# EAGLE design IO_master_nano (EAGLE 7.2.0)
AUTHOR: M. Petrilak; VERSION: 01
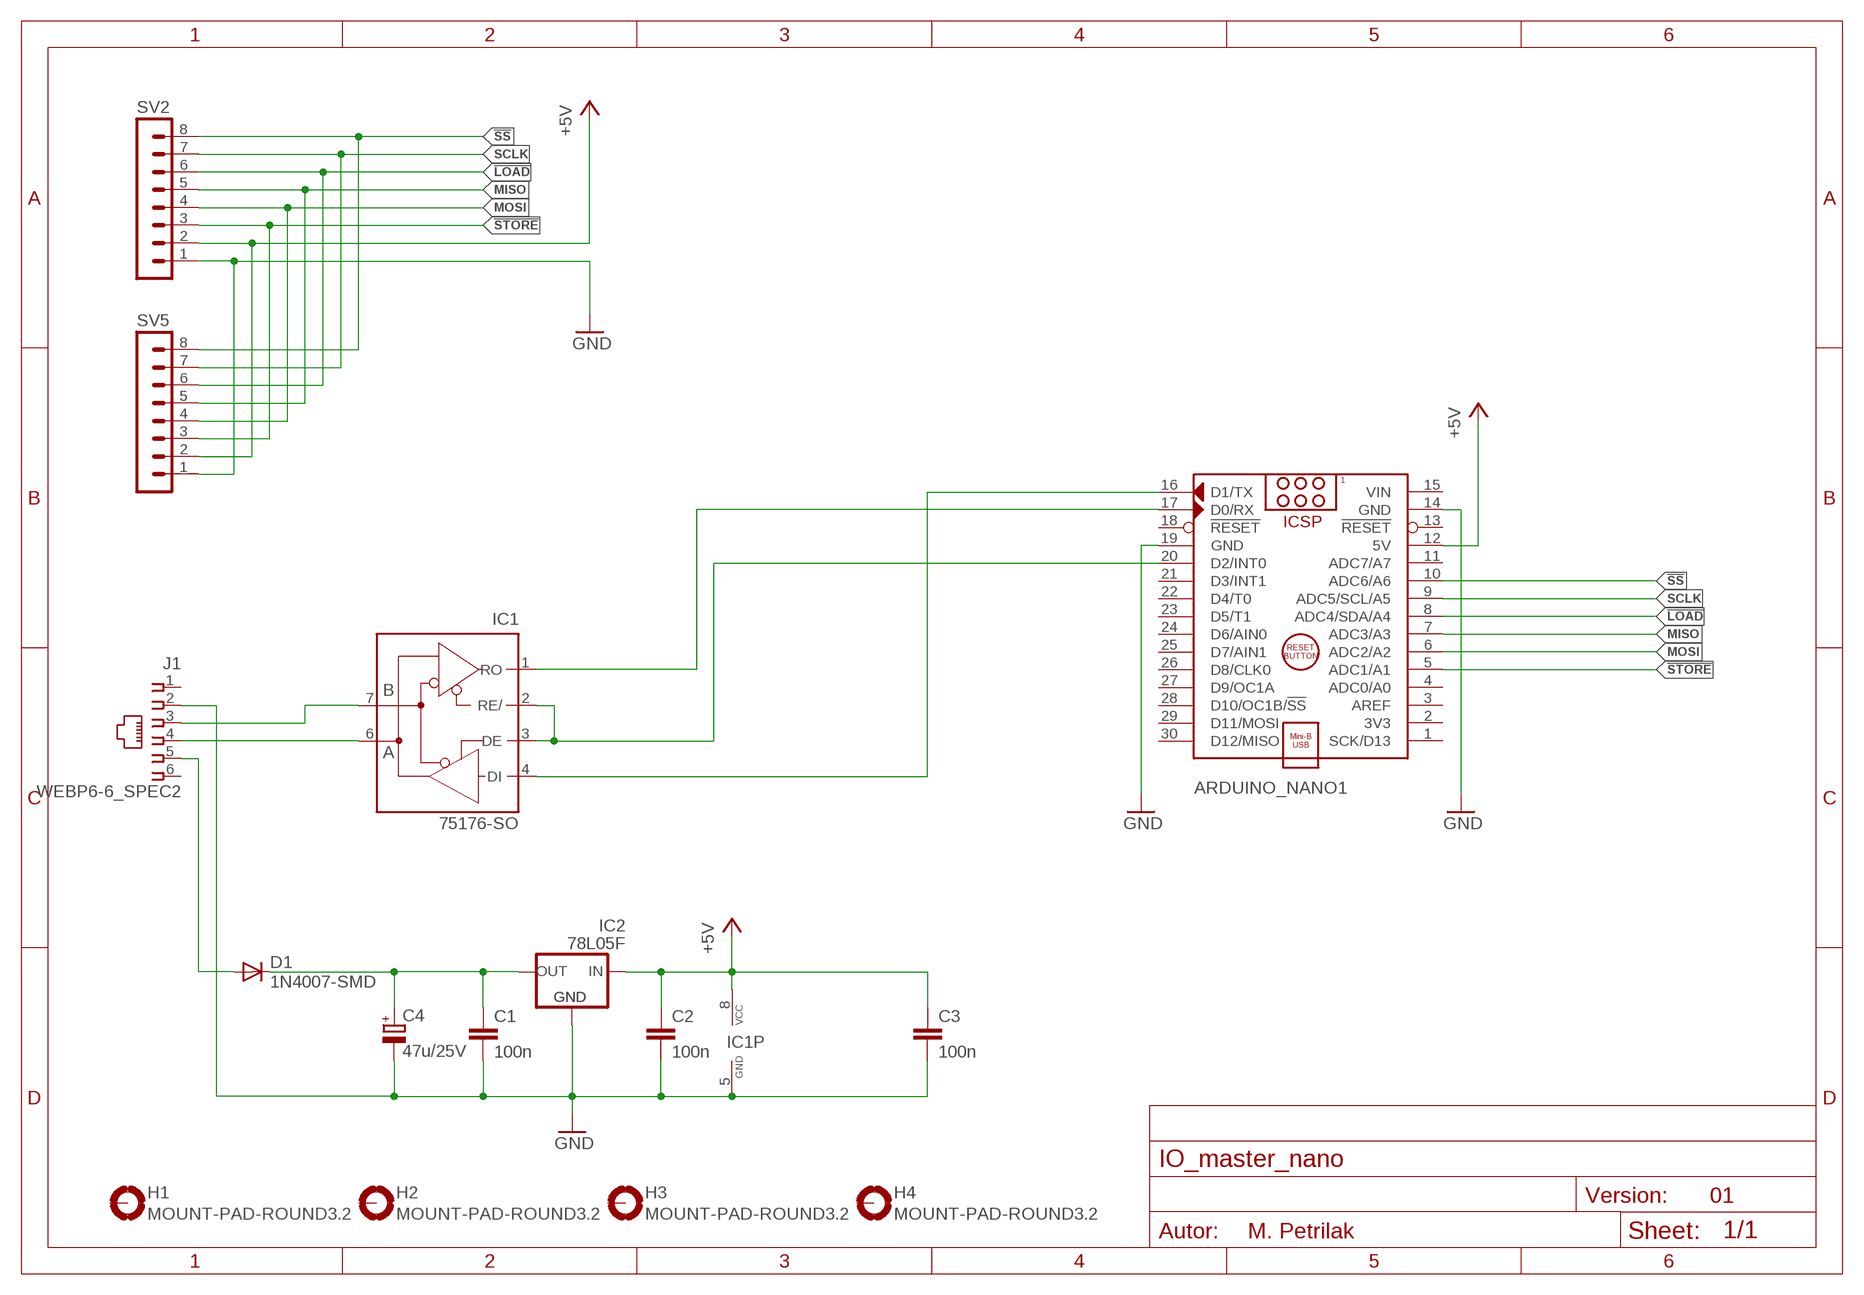
[diagram p0: schematic, sheet 1]

## Parts
ARDUINO_NANO1  ARDUINO_NANO_2  [ARDUINO_NANO2]
C1  100n  C-EUC1206  [C1206]
C2  100n  C-EUC1206  [C1206]
C3  100n  C-EUC1206  [C1206]
C4  47u/25V  CPOL-EUE2.5-6L  [E2,5-6L]
D1  1N4007-SMD  [SMA-DO214AC]
H1  MOUNT-PAD-ROUND3.2  [3,2-PAD]
H2  MOUNT-PAD-ROUND3.2  [3,2-PAD]
H3  MOUNT-PAD-ROUND3.2  [3,2-PAD]
H4  MOUNT-PAD-ROUND3.2  [3,2-PAD]
IC1  75176-SO  [SO08]
IC2  78L05F  [SOT89]
J1  WEBP6-6_SPEC2  [WEBP6-6_SPEC2]
SV2  MA08-1  [MA08-1]
SV5  MA08-1  [MA08-1]

## Nets
!LOAD: ARDUINO_NANO1.8(ADC4/SDA/A4) SV2.6 SV5.6
!SS: ARDUINO_NANO1.10(ADC6/A6) SV2.8 SV5.8
!STORE: ARDUINO_NANO1.5(ADC1/A1) SV2.3 SV5.3
+5V: ARDUINO_NANO1.12(5V) C2.1 C3.1 IC1.8(VCC) IC2.3(VI) SV2.2 SV5.2
GND: ARDUINO_NANO1.14(GND) ARDUINO_NANO1.19(GND) C1.2 C2.2 C3.2 C4.- IC1.5(GND) IC2.2(GND) IC2.2@1(GND) J1.2 SV2.1 SV5.1
MISO: ARDUINO_NANO1.7(ADC3/A3) SV2.5 SV5.5
MOSI: ARDUINO_NANO1.6(ADC2/A2) SV2.4 SV5.4
N$1: D1.A J1.5
N$2: C1.1 C4.+ D1.K(C) IC2.1(VO)
N$4: IC1.6(A) J1.4
N$5: IC1.7(B) J1.3
N$6: ARDUINO_NANO1.20(D2/INT0) IC1.2(RE/) IC1.3(DE)
N$7: ARDUINO_NANO1.16(D1/TX) IC1.4(DI)
N$8: ARDUINO_NANO1.17(D0/RX) IC1.1(RO)
SCLK: ARDUINO_NANO1.9(ADC5/SCL/A5) SV2.7 SV5.7
Unconnected: ARDUINO_NANO1.1(SCK/D13) ARDUINO_NANO1.2(3V3) ARDUINO_NANO1.3(AREF) ARDUINO_NANO1.4(ADC0/A0) ARDUINO_NANO1.11(ADC7/A7) ARDUINO_NANO1.13(!RESET) ARDUINO_NANO1.18(!RESET) ARDUINO_NANO1.21(D3/INT1) ARDUINO_NANO1.22(D4/T0) ARDUINO_NANO1.23(D5/T1) ARDUINO_NANO1.24(D6/AIN0) ARDUINO_NANO1.25(D7/AIN1) ARDUINO_NANO1.26(D8/CLK0) ARDUINO_NANO1.27(D9/OC1A) ARDUINO_NANO1.28(D10/OC1B/!SS) ARDUINO_NANO1.29(D11/MOSI) ARDUINO_NANO1.30(D12/MISO) H1.B3,2(MOUNT) H2.B3,2(MOUNT) H3.B3,2(MOUNT) H4.B3,2(MOUNT) J1.1 J1.6

## Power pins joined to a net without a drawn wire
VIN: ARDUINO_NANO1.15(VIN)

## Library data of the parts
ARDUINO_NANO1 = arduino:ARDUINO_NANO: Arduino Nano V3.0 Module Overview: The Arduino Nano is a small, complete, and breadboard-friendly board based on the ATmega328 (Arduino Nano 3.x) or ATmega168 (Arduino Nano 2.x). It has more or less the same functionality of the Arduino Duemilanove, but in a different package. It lacks only a DC power jack, and works with a Mini-B USB cable instead of a standard one. The Nano was designed and is being produced by Gravitech <http://www.gravitech.us/arna30wiatp.html>. General specifications: Item Value Microcontroller Atmel ATmega168 or ATmega328 Operating Voltage (logic level) 5 V Input Voltage (recommended) 7-12 V Input Voltage (limits) 6-20 V Digital I/O Pins 14 (of which 6 provide PWM output) Analog Input Pins 8 DC Current per I/O Pin 40 mA Flash Memory 16 KB (ATmega168) or 32 KB (ATmega328) of which 2 KB used by bootloader SRAM 1 KB (ATmega168) or 2 KB (ATmega328) EEPROM 512 bytes (ATmega168) or 1 KB (ATmega328) Clock Speed 16 MHz Dimensions (Inches) 0.73" x 1.70" Dimensions (mm) 18mm x 45mm Overall height About 9 mm (not including pins) Weigth 5 g Power: The Arduino Nano can be powered via the Mini-B USB connection, 6-20V unregulated external power supply (pin 30), or 5V regulated external power supply (pin 27). The power source is automatically selected to the highest voltage source. Memory: The ATmega168 has 16 KB of flash memory for storing code (of which 2 KB is used for the bootloader); the ATmega328 has 32 KB, (also with 2 KB used for the bootloader). The ATmega168 has 1 KB of SRAM and 512 bytes of EEPROM (which can be read and written with the EEPROM library); the ATmega328 has 2 KB of SRAM and 1 KB of EEPROM. Input and Output: Each of the 14 digital pins on the Nano can be used as an input or output, using pinMode(), digitalWrite(), and digitalRead() functions. They operate at 5 volts. Each pin can provide or receive a maximum of 40 mA and has an internal pull-up resistor (disconnected by default) of 20-50 kOhms. In addition, some pins have specialized functions. Visit Arduino - ArduinoBoardNano <https://www.arduino.cc/en/Main/ArduinoBoardNano>
C1-C3 = rcl:C-EU: CAPACITOR, European symbol
C4 = rcl:CPOL-EU: POLARIZED CAPACITOR, European symbol
D1 = diode:1N400: DIODE general purpose rectifier, 1 A
H1-H4 = holes:MOUNT-PAD-ROUND: MOUNTING PAD, round
IC1 = maxim:75176
IC2 = linear:78L*: POSITOIV-VOLTAGE REGULATORS Output up to 100 mA Source: http://focus.ti.com/lit/ds/symlink/ua78l05.pdf
J1 = con-malina:WEBP6-6
SV2 SV5 = con-lstb:MA08-1: PIN HEADER

## Board
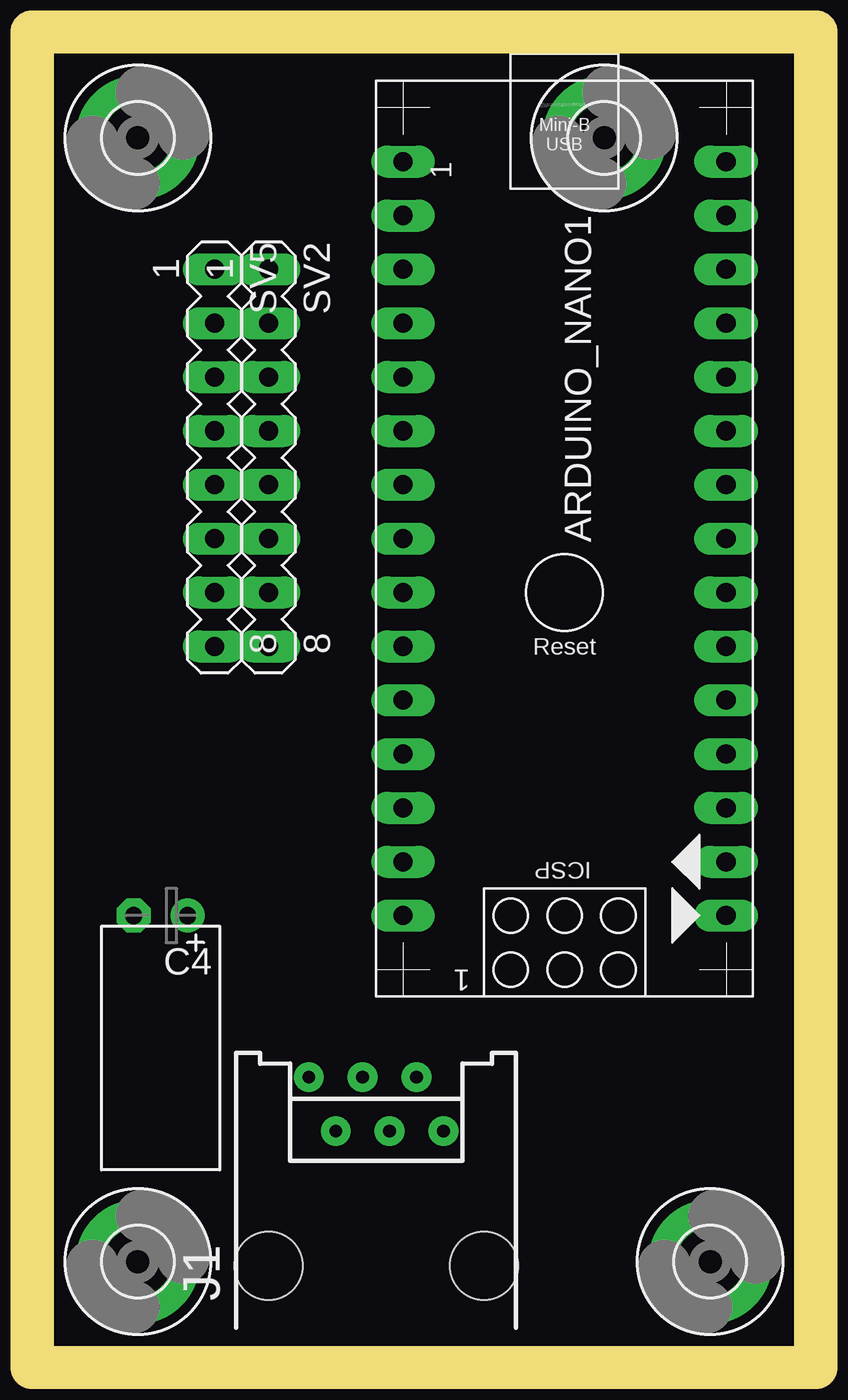
[diagram p1: board, top side]
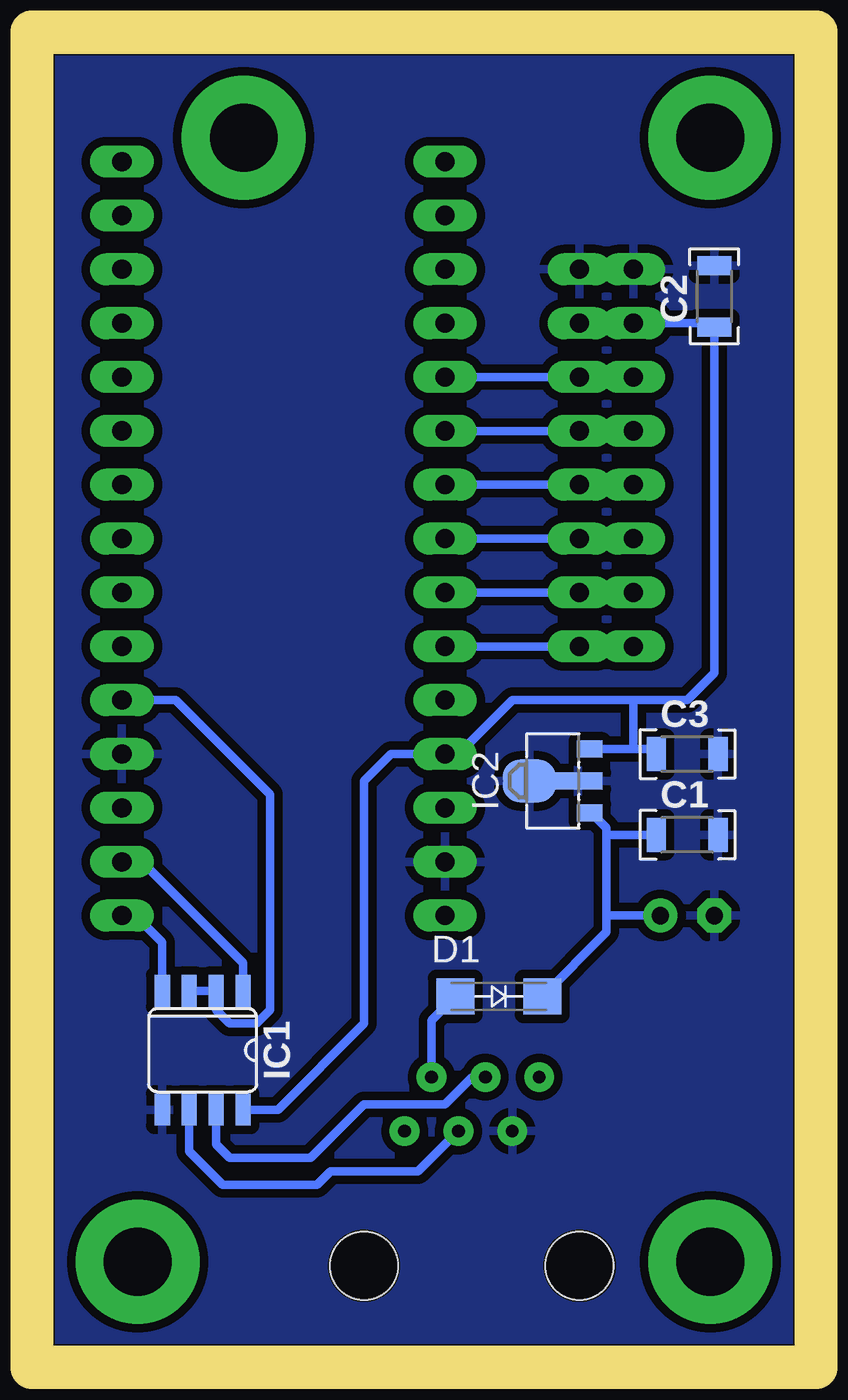
[diagram p2: board, bottom side, seen from below]

Size 35 x 61 mm. Coordinates in mm from the lower left corner, seen from the top.
Outline: 0,0 35,0 35,61 0,61 0,0
Copper layers (1*16): Top 0.035mm / dielectric 1.5mm / Bottom 0.035mm
Design rules "Michal_CNC_doma": minimum track width 0.3mm, minimum drill 0.6mm, track to track 0.4mm, track to pad 0.4mm, pad to pad 0.5mm, via to via 0.5mm, smd to smd 8mil, copper to edge 0.1mm, drill to drill 0.3mm, minimum pad ring 0.2mm, minimum via ring 0.2mm, stop-mask expansion 4mil, vias tented up to drill 0mil, thermal gap 0.4mm
Milling: 4 lines

### Footprints (pad centres in the part's own frame; a part is rotated, then mirrored left to right if it is on the bottom)
ARDUINO_NANO2 = drill 0.9 pad 1.5 long: 1 -20.32,-7.62; 2 -17.78,-7.62; 3 -15.24,-7.62; 4 -12.7,-7.62; 5 -10.16,-7.62; 6 -7.62,-7.62; 7 -5.08,-7.62; 8 -2.54,-7.62; 9 0,-7.62; 10 2.54,-7.62; 11 5.08,-7.62; 12 7.62,-7.62; 13 10.16,-7.62; 14 12.7,-7.62; 15 15.24,-7.62; 16 15.24,7.62; 17 12.7,7.62; 18 10.16,7.62; 19 7.62,7.62; 20 5.08,7.62; 21 2.54,7.62; 22 0,7.62; 23 -2.54,7.62; 24 -5.08,7.62; 25 -7.62,7.62; 26 -10.16,7.62; 27 -12.7,7.62; 28 -15.24,7.62; 29 -17.78,7.62; 30 -20.32,7.62
C1206 = smd 0.9 x 1.6: 1 -1.45,0; 2 1.45,0
E2,5-6L = drill 0.813 pad 1.6: + -1.27,0 | drill 0.813 pad 1.6 octagon: - 1.27,0
SMA-DO214AC = smd 1.8 x 1.7: A -2.05,0; K 2.05,0
3,2-PAD = drill 3.2 pad 5.842: B3,2 0,0
SO08 = smd 0.72 x 1.5: 1 -1.905,-2.8; 2 -0.635,-2.8; 3 0.635,-2.8; 4 1.905,-2.8; 5 1.905,2.8; 6 0.635,2.8; 7 -0.635,2.8; 8 -1.905,2.8
SOT89 = smd 0.8 x 1.2: 1 -1.5,-1.75; 3 1.499,-1.75 | smd 0.8 x 2.3: 2 0,-1.2 | smd 2 x 2.5: 2@1 0,1.1
WEBP6-6_SPEC2 = drill 0.6 pad 1.4: 1 -3.175,8.89; 2 -1.905,6.35; 3 -0.635,8.89; 4 0.635,6.35; 5 1.905,8.89; 6 3.175,6.35 | hole 3.2: -5.08,0; 5.08,0
MA08-1 = drill 0.9 pad 1.5 long: 1 -8.89,0; 2 -6.35,0; 3 -3.81,0; 4 -1.27,0; 5 1.27,0; 6 3.81,0; 7 6.35,0; 8 8.89,0

### Placement (x,y rotation side)
ARDUINO_NANO1  24.13,35.56 270 top
C1  5.08,24.13 0 bottom
C2  3.81,49.53 90 bottom
C3  5.08,27.94 0 bottom
C4  5.08,20.32 180 top
D1  13.97,16.51 0 bottom
H1  4,4 0 top
H2  31,4 0 top
H3  26,57 0 top
H4  4,57 0 top
IC1  27.94,13.97 180 bottom
IC2  11.43,26.67 90 bottom
J1  15.24,3.81 0 top
SV2  10.16,41.91 270 top
SV5  7.62,41.91 270 top

### Tracks (layer width: path | path; a pad name or v marks a point on that pad's centre or on a via)
!LOAD
  Bottom 0.406: SV5.6 SV2.6 ARDUINO_NANO1.8
!SS
  Bottom 0.406: SV5.8 SV2.8 ARDUINO_NANO1.10
!STORE
  Bottom 0.406: ARDUINO_NANO1.5 SV2.3 SV5.3
+5V
  Bottom 0.406: SV2.2 SV5.2 3.99,48.26 C2.1 3.81,31.75 5.08,30.48 7.62,30.48 | 7.62,30.48 13.34,30.48 15.88,27.94 ARDUINO_NANO1.12 19.05,27.94 20.32,26.67 20.32,15.24 24.39,11.17 IC1.8 | IC2.3 7.62,28.17 | 7.62,28.17 7.62,30.48 | C3.1 6.53,28.17 7.62,28.17
GND
  pour Bottom: 0,0 35,0 35,61 0,61
MISO
  Bottom 0.406: ARDUINO_NANO1.7 SV2.5 SV5.5
MOSI
  Bottom 0.406: SV5.4 SV2.4 ARDUINO_NANO1.6
N$1
  Bottom 0.406: J1.5 17.14,15.38 D1.A
N$2
  Bottom 0.406: D1.K 8.89,19.54 8.89,20.32 | C4.+ 8.89,20.32 | 8.89,20.32 8.89,24.13 | 8.89,24.13 8.89,24.45 9.61,25.17 IC2.1 | C1.1 8.89,24.13
N$4
  Bottom 0.406: IC1.6 28.57,9.21 26.99,7.62 22.54,7.62 21.91,8.26 17.78,8.26 J1.4
N$5
  Bottom 0.406: J1.3 15.24,12.7 16.51,11.43 20.32,11.43 22.86,8.89 26.67,8.89 27.3,9.53 IC1.7
N$6
  Bottom 0.406: 33.02,30.48 ARDUINO_NANO1.20 29.21,30.48 24.77,26.04 24.77,15.88 25.4,15.24 26.67,15.24 27.3,15.88 IC1.2 IC1.3
N$7
  Bottom 0.406: IC1.4 29.84,19.05 31.11,20.32 ARDUINO_NANO1.16
N$8
  Bottom 0.406: IC1.1 26.04,18.1 30.8,22.86 ARDUINO_NANO1.17
SCLK
  Bottom 0.406: ARDUINO_NANO1.9 SV2.7 SV5.7